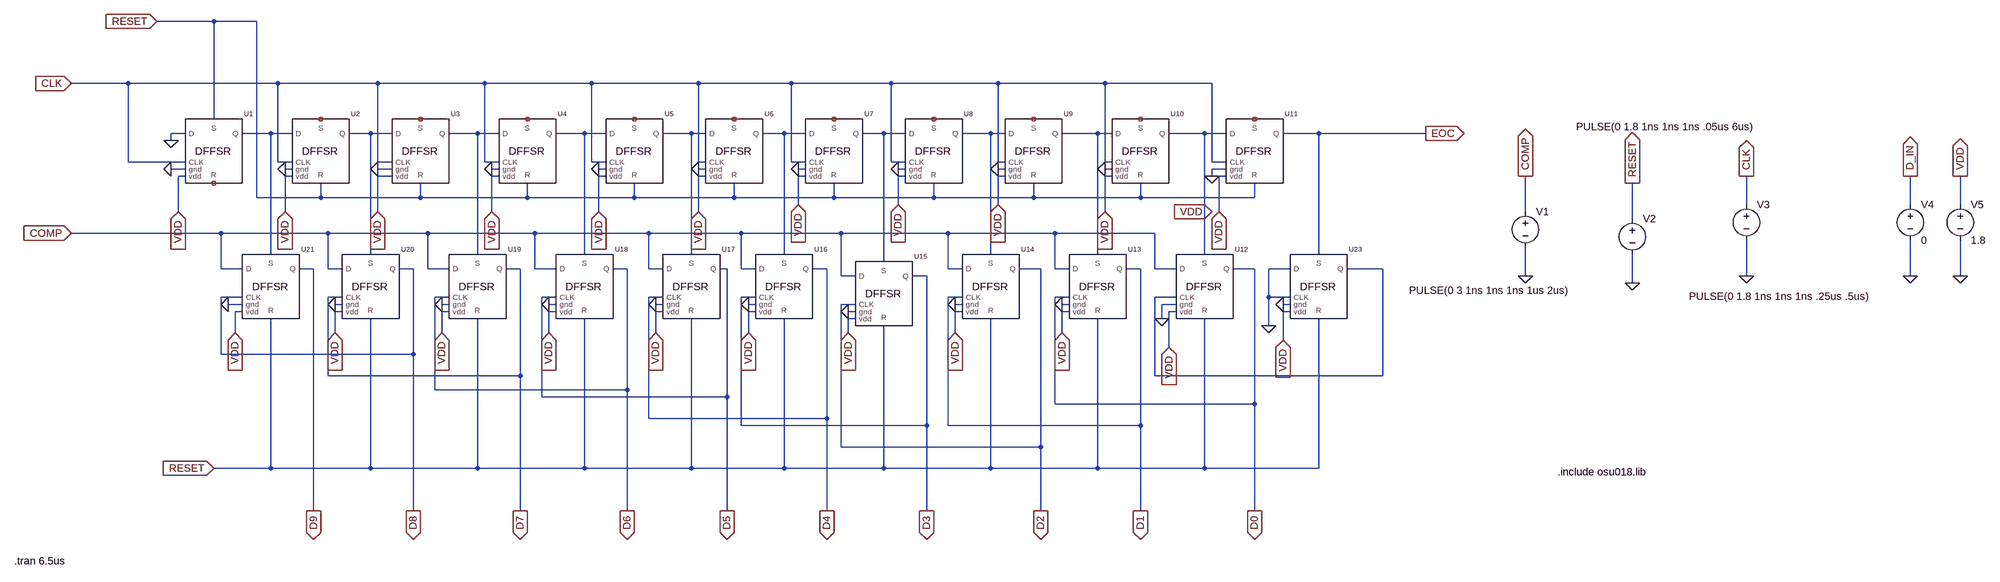
[diagram p0: schematic SARlogic_10BIT.asc]
SARlogic_10BIT.asc, the LTspice schematic file:
Version 4
SHEET 1 1368 872
WIRE -2624 -432 -2752 -432
WIRE -2528 -432 -2624 -432
WIRE -2816 -256 -2944 -256
WIRE -2480 -256 -2816 -256
WIRE -2256 -256 -2480 -256
WIRE -2016 -256 -2256 -256
WIRE -1776 -256 -2016 -256
WIRE -1536 -256 -1776 -256
WIRE -1328 -256 -1536 -256
WIRE -1104 -256 -1328 -256
WIRE -864 -256 -1104 -256
WIRE -624 -256 -864 -256
WIRE -384 -256 -624 -256
WIRE -2624 -176 -2624 -432
WIRE -2688 -144 -2720 -144
WIRE -2496 -144 -2560 -144
WIRE -2448 -144 -2496 -144
WIRE -2272 -144 -2320 -144
WIRE -2224 -144 -2272 -144
WIRE -2032 -144 -2096 -144
WIRE -1984 -144 -2032 -144
WIRE -1792 -144 -1856 -144
WIRE -1744 -144 -1792 -144
WIRE -1552 -144 -1616 -144
WIRE -1520 -144 -1552 -144
WIRE -1344 -144 -1392 -144
WIRE -1296 -144 -1344 -144
WIRE -1120 -144 -1168 -144
WIRE -1072 -144 -1120 -144
WIRE -880 -144 -944 -144
WIRE -848 -144 -880 -144
WIRE -640 -144 -720 -144
WIRE -608 -144 -640 -144
WIRE -400 -144 -480 -144
WIRE -352 -144 -400 -144
WIRE -144 -144 -224 -144
WIRE 96 -144 -144 -144
WIRE -2720 -128 -2720 -144
WIRE -2816 -80 -2816 -256
WIRE -2688 -80 -2816 -80
WIRE -2480 -80 -2480 -256
WIRE -2448 -80 -2480 -80
WIRE -2256 -80 -2256 -256
WIRE -2224 -80 -2256 -80
WIRE -2016 -80 -2016 -256
WIRE -1984 -80 -2016 -80
WIRE -1776 -80 -1776 -256
WIRE -1744 -80 -1776 -80
WIRE -1536 -80 -1536 -256
WIRE -1520 -80 -1536 -80
WIRE -1328 -80 -1328 -256
WIRE -1296 -80 -1328 -80
WIRE -1104 -80 -1104 -256
WIRE -1072 -80 -1104 -80
WIRE -864 -80 -864 -256
WIRE -848 -80 -864 -80
WIRE -624 -80 -624 -256
WIRE -608 -80 -624 -80
WIRE -384 -80 -384 -256
WIRE -352 -80 -384 -80
WIRE -2688 -64 -2720 -64
WIRE -2448 -64 -2464 -64
WIRE -2224 -64 -2256 -64
WIRE -1984 -64 -2000 -64
WIRE -1744 -64 -1760 -64
WIRE -1520 -64 -1536 -64
WIRE -1296 -64 -1312 -64
WIRE -1072 -64 -1088 -64
WIRE -848 -64 -864 -64
WIRE -608 -64 -624 -64
WIRE -352 -64 -384 -64
WIRE -2688 -48 -2704 -48
WIRE -2448 -48 -2464 -48
WIRE -2224 -48 -2256 -48
WIRE -1984 -48 -2000 -48
WIRE -1744 -48 -1760 -48
WIRE -1520 -48 -1536 -48
WIRE -1296 -48 -1312 -48
WIRE -1072 -48 -1088 -48
WIRE -848 -48 -864 -48
WIRE -608 -48 -624 -48
WIRE -384 -48 -384 -64
WIRE -352 -48 -368 -48
WIRE -2528 0 -2528 -432
WIRE -2384 0 -2384 -32
WIRE -2384 0 -2528 0
WIRE -2160 0 -2160 -32
WIRE -2160 0 -2384 0
WIRE -1920 0 -1920 -32
WIRE -1920 0 -2160 0
WIRE -1680 0 -1680 -32
WIRE -1680 0 -1920 0
WIRE -1456 0 -1456 -32
WIRE -1456 0 -1680 0
WIRE -1232 0 -1232 -32
WIRE -1232 0 -1456 0
WIRE -1008 0 -1008 -32
WIRE -1008 0 -1232 0
WIRE -784 0 -784 -32
WIRE -784 0 -1008 0
WIRE -544 0 -544 -32
WIRE -544 0 -784 0
WIRE -288 0 -288 -32
WIRE -288 0 -544 0
WIRE -1312 16 -1312 -48
WIRE -1088 16 -1088 -48
WIRE -864 16 -864 -48
WIRE 816 16 816 -48
WIRE 1184 16 1184 -48
WIRE 1296 16 1296 -48
WIRE -2704 32 -2704 -48
WIRE -2464 32 -2464 -48
WIRE -2256 32 -2256 -48
WIRE -2000 32 -2000 -48
WIRE -1760 32 -1760 -48
WIRE -1536 32 -1536 -48
WIRE -624 32 -624 -48
WIRE -368 32 -368 -48
WIRE 320 32 320 -48
WIRE 560 48 560 -32
WIRE -2608 80 -2944 80
WIRE -2368 80 -2608 80
WIRE -2144 80 -2368 80
WIRE -1904 80 -2144 80
WIRE -1648 80 -1904 80
WIRE -1440 80 -1648 80
WIRE -1216 80 -1440 80
WIRE -976 80 -1216 80
WIRE -736 80 -976 80
WIRE -512 80 -736 80
WIRE -2496 128 -2496 -144
WIRE -2272 128 -2272 -144
WIRE -2032 128 -2032 -144
WIRE -1792 128 -1792 -144
WIRE -1552 128 -1552 -144
WIRE -1344 128 -1344 -144
WIRE -880 128 -880 -144
WIRE -640 128 -640 -144
WIRE -400 128 -400 -144
WIRE -144 128 -144 -144
WIRE -1120 144 -1120 -144
WIRE -2608 160 -2608 80
WIRE -2560 160 -2608 160
WIRE -2400 160 -2432 160
WIRE -2368 160 -2368 80
WIRE -2336 160 -2368 160
WIRE -2176 160 -2208 160
WIRE -2144 160 -2144 80
WIRE -2096 160 -2144 160
WIRE -1936 160 -1968 160
WIRE -1904 160 -1904 80
WIRE -1856 160 -1904 160
WIRE -1696 160 -1728 160
WIRE -1648 160 -1648 80
WIRE -1616 160 -1648 160
WIRE -1472 160 -1488 160
WIRE -1440 160 -1440 80
WIRE -1408 160 -1440 160
WIRE -1248 160 -1280 160
WIRE -976 160 -976 80
WIRE -944 160 -976 160
WIRE -768 160 -816 160
WIRE -736 160 -736 80
WIRE -704 160 -736 160
WIRE -544 160 -576 160
WIRE -512 160 -512 80
WIRE -464 160 -512 160
WIRE -288 160 -336 160
WIRE -208 160 -256 160
WIRE 0 160 -80 160
WIRE -1216 176 -1216 80
WIRE -1184 176 -1216 176
WIRE -1024 176 -1056 176
WIRE 320 176 320 112
WIRE 816 176 816 96
WIRE 1184 176 1184 96
WIRE 1296 176 1296 96
WIRE 560 192 560 128
WIRE -2560 224 -2608 224
WIRE -2336 224 -2368 224
WIRE -2096 224 -2128 224
WIRE -1856 224 -1888 224
WIRE -1616 224 -1648 224
WIRE -1408 224 -1440 224
WIRE -944 224 -976 224
WIRE -704 224 -736 224
WIRE -464 224 -512 224
WIRE -256 224 -256 160
WIRE -208 224 -256 224
WIRE -2560 240 -2592 240
WIRE -2336 240 -2352 240
WIRE -2096 240 -2112 240
WIRE -1856 240 -1872 240
WIRE -1616 240 -1632 240
WIRE -1408 240 -1424 240
WIRE -1184 240 -1216 240
WIRE -944 240 -960 240
WIRE -704 240 -720 240
WIRE -464 240 -496 240
WIRE -208 240 -224 240
WIRE -2560 256 -2576 256
WIRE -2336 256 -2352 256
WIRE -2096 256 -2112 256
WIRE -1856 256 -1872 256
WIRE -1616 256 -1632 256
WIRE -1408 256 -1424 256
WIRE -1184 256 -1200 256
WIRE -944 256 -960 256
WIRE -704 256 -720 256
WIRE -464 256 -480 256
WIRE -208 256 -224 256
WIRE -1184 272 -1200 272
WIRE -496 272 -496 240
WIRE -256 288 -256 224
WIRE -2576 304 -2576 256
WIRE -2352 304 -2352 256
WIRE -2112 304 -2112 256
WIRE -1872 304 -1872 256
WIRE -1632 304 -1632 256
WIRE -1424 304 -1424 256
WIRE -1200 304 -1200 272
WIRE -960 304 -960 256
WIRE -720 304 -720 256
WIRE -224 320 -224 256
WIRE -480 336 -480 256
WIRE -2608 352 -2608 224
WIRE -2176 352 -2176 160
WIRE -2176 352 -2608 352
WIRE -2368 400 -2368 224
WIRE -1936 400 -1936 160
WIRE -1936 400 -2368 400
WIRE -512 400 -512 224
WIRE 0 400 0 160
WIRE 0 400 -512 400
WIRE -2128 432 -2128 224
WIRE -1696 432 -1696 160
WIRE -1696 432 -2128 432
WIRE -1888 448 -1888 224
WIRE -1472 448 -1472 160
WIRE -1472 448 -1888 448
WIRE -736 464 -736 224
WIRE -288 464 -288 160
WIRE -288 464 -736 464
WIRE -1648 496 -1648 224
WIRE -1248 496 -1248 160
WIRE -1248 496 -1648 496
WIRE -1440 512 -1440 224
WIRE -1024 512 -1024 176
WIRE -1024 512 -1440 512
WIRE -976 512 -976 224
WIRE -544 512 -544 160
WIRE -544 512 -976 512
WIRE -1216 560 -1216 240
WIRE -768 560 -768 160
WIRE -768 560 -1216 560
WIRE -2496 608 -2496 272
WIRE -2496 608 -2624 608
WIRE -2272 608 -2272 272
WIRE -2272 608 -2496 608
WIRE -2032 608 -2032 272
WIRE -2032 608 -2272 608
WIRE -1792 608 -1792 272
WIRE -1792 608 -2032 608
WIRE -1552 608 -1552 272
WIRE -1552 608 -1792 608
WIRE -1344 608 -1344 272
WIRE -1344 608 -1552 608
WIRE -1120 608 -1120 288
WIRE -1120 608 -1344 608
WIRE -880 608 -880 272
WIRE -880 608 -1120 608
WIRE -640 608 -640 272
WIRE -640 608 -880 608
WIRE -400 608 -400 272
WIRE -400 608 -640 608
WIRE -144 608 -144 272
WIRE -144 608 -400 608
WIRE -2400 704 -2400 160
WIRE -2176 704 -2176 352
WIRE -1936 704 -1936 400
WIRE -1696 704 -1696 432
WIRE -1472 704 -1472 448
WIRE -1248 704 -1248 496
WIRE -1024 704 -1024 512
WIRE -768 704 -768 560
WIRE -544 704 -544 512
WIRE -288 704 -288 464
FLAG 320 176 0
FLAG 560 192 0
FLAG 816 176 0
FLAG 1184 176 0
FLAG 1296 176 0
FLAG 560 -32 RESET
IOPIN 560 -32 Out
FLAG 816 -48 CLK
IOPIN 816 -48 Out
FLAG 1184 -48 D_IN
IOPIN 1184 -48 Out
FLAG 1296 -48 VDD
IOPIN 1296 -48 Out
FLAG 320 -48 COMP
IOPIN 320 -48 Out
FLAG -2400 704 D9
IOPIN -2400 704 Out
FLAG -2176 704 D8
IOPIN -2176 704 Out
FLAG -1936 704 D7
IOPIN -1936 704 Out
FLAG -1696 704 D6
IOPIN -1696 704 Out
FLAG -1472 704 D5
IOPIN -1472 704 Out
FLAG -1248 704 D4
IOPIN -1248 704 Out
FLAG -1024 704 D3
IOPIN -1024 704 Out
FLAG -768 704 D2
IOPIN -768 704 Out
FLAG -544 704 D1
IOPIN -544 704 Out
FLAG -288 704 D0
IOPIN -288 704 Out
FLAG 96 -144 EOC
IOPIN 96 -144 Out
FLAG -2944 -256 CLK
IOPIN -2944 -256 In
FLAG -2752 -432 RESET
IOPIN -2752 -432 In
FLAG -2944 80 COMP
IOPIN -2944 80 In
FLAG -2624 608 RESET
IOPIN -2624 608 In
FLAG -256 288 0
FLAG -2576 304 VDD
IOPIN -2576 304 In
FLAG -2352 304 VDD
IOPIN -2352 304 In
FLAG -2112 304 VDD
IOPIN -2112 304 In
FLAG -1872 304 VDD
IOPIN -1872 304 In
FLAG -1632 304 VDD
IOPIN -1632 304 In
FLAG -1200 304 VDD
IOPIN -1200 304 In
FLAG -1424 304 VDD
IOPIN -1424 304 In
FLAG -960 304 VDD
IOPIN -960 304 In
FLAG -720 304 VDD
IOPIN -720 304 In
FLAG -480 336 VDD
IOPIN -480 336 In
FLAG -2000 32 VDD
IOPIN -2000 32 In
FLAG -1760 32 VDD
IOPIN -1760 32 In
FLAG -1536 32 VDD
IOPIN -1536 32 In
FLAG -1312 16 VDD
IOPIN -1312 16 In
FLAG -1088 16 VDD
IOPIN -1088 16 In
FLAG -864 16 VDD
IOPIN -864 16 In
FLAG -624 32 VDD
IOPIN -624 32 In
FLAG -384 32 VDD
IOPIN -384 32 In
FLAG -368 32 VDD
IOPIN -368 32 In
FLAG -2464 32 VDD
IOPIN -2464 32 In
FLAG -2704 32 VDD
IOPIN -2704 32 In
FLAG -2256 32 VDD
IOPIN -2256 32 In
FLAG -2720 -64 0
FLAG -2464 -64 0
FLAG -2256 -64 0
FLAG -2000 -64 0
FLAG -1760 -64 0
FLAG -1536 -64 0
FLAG -1312 -64 0
FLAG -1088 -64 0
FLAG -864 -64 0
FLAG -2592 240 0
FLAG -2352 240 0
FLAG -2112 240 0
FLAG -1872 240 0
FLAG -1632 240 0
FLAG -1424 240 0
FLAG -1200 256 0
FLAG -960 240 0
FLAG -720 240 0
FLAG -2720 -128 0
FLAG -624 -64 0
FLAG -384 -48 0
FLAG -496 272 0
FLAG -224 240 0
FLAG -224 320 VDD
IOPIN -224 320 In
SYMBOL voltage 320 16 R0
WINDOW 3 -261 193 Left 2
WINDOW 123 0 0 Left 0
WINDOW 39 0 0 Left 0
SYMATTR Value PULSE(0 3 1ns 1ns 1ns 1us 2us)
SYMATTR InstName V1
SYMBOL voltage 560 32 R0
WINDOW 3 -126 -191 Left 2
WINDOW 123 0 0 Left 0
WINDOW 39 0 0 Left 0
SYMATTR Value PULSE(0 1.8 1ns 1ns 1ns .05us 6us)
SYMATTR InstName V2
SYMBOL voltage 816 0 R0
WINDOW 3 -129 222 Left 2
WINDOW 123 0 0 Left 0
WINDOW 39 0 0 Left 0
SYMATTR Value PULSE(0 1.8 1ns 1ns 1ns .25us .5us)
SYMATTR InstName V3
SYMBOL voltage 1184 0 R0
WINDOW 123 0 0 Left 0
WINDOW 39 0 0 Left 0
SYMATTR InstName V4
SYMATTR Value 0
SYMBOL voltage 1296 0 R0
WINDOW 123 0 0 Left 0
WINDOW 39 0 0 Left 0
SYMATTR InstName V5
SYMATTR Value 1.8
SYMBOL AutoGenerated\\DFFSR -2624 -112 R0
SYMATTR InstName U1
SYMATTR Value2 vhigh=1.8 vlow=0
SYMATTR SpiceLine Trise=1ns Tfall=1ns
SYMBOL AutoGenerated\\DFFSR -2384 -112 R0
SYMATTR InstName U2
SYMATTR SpiceLine Trise=1ns Tfall=1ns
SYMATTR Value2 vhigh=1.8 vlow=0
SYMBOL AutoGenerated\\DFFSR -2160 -112 R0
SYMATTR InstName U3
SYMATTR SpiceLine Trise=1ns Tfall=1ns
SYMATTR Value2 vhigh=1.8 vlow=0
SYMBOL AutoGenerated\\DFFSR -1920 -112 R0
SYMATTR InstName U4
SYMATTR SpiceLine Trise=1ns Tfall=1ns
SYMATTR Value2 vhigh=1.8 vlow=0
SYMBOL AutoGenerated\\DFFSR -1680 -112 R0
SYMATTR InstName U5
SYMATTR SpiceLine Trise=1ns Tfall=1ns
SYMATTR Value2 vhigh=1.8 vlow=0
SYMBOL AutoGenerated\\DFFSR -1456 -112 R0
SYMATTR InstName U6
SYMATTR SpiceLine Trise=1ns Tfall=1ns
SYMATTR Value2 vhigh=1.8 vlow=0
SYMBOL AutoGenerated\\DFFSR -1232 -112 R0
SYMATTR InstName U7
SYMATTR SpiceLine Trise=1ns Tfall=1ns
SYMATTR Value2 vhigh=1.8 vlow=0
SYMBOL AutoGenerated\\DFFSR -1008 -112 R0
SYMATTR InstName U8
SYMATTR SpiceLine Trise=1ns Tfall=1ns
SYMATTR Value2 vhigh=1.8 vlow=0
SYMBOL AutoGenerated\\DFFSR -784 -112 R0
SYMATTR InstName U9
SYMATTR SpiceLine Trise=1ns Tfall=1ns
SYMATTR Value2 vhigh=1.8 vlow=0
SYMBOL AutoGenerated\\DFFSR -544 -112 R0
SYMATTR InstName U10
SYMATTR SpiceLine Trise=1ns Tfall=1ns
SYMATTR Value2 vhigh=1.8 vlow=0
SYMBOL AutoGenerated\\DFFSR -288 -112 R0
SYMATTR InstName U11
SYMATTR SpiceLine Trise=1ns Tfall=1ns
SYMATTR Value2 vhigh=1.8 vlow=0
SYMBOL AutoGenerated\\DFFSR -400 192 R0
SYMATTR InstName U12
SYMATTR SpiceLine Trise=1ns Tfall=1ns
SYMATTR Value2 vhigh=1.8 vlow=0
SYMBOL AutoGenerated\\DFFSR -640 192 R0
SYMATTR InstName U13
SYMATTR SpiceLine Trise=1ns Tfall=1ns
SYMATTR Value2 vhigh=1.8 vlow=0
SYMBOL AutoGenerated\\DFFSR -880 192 R0
SYMATTR InstName U14
SYMATTR SpiceLine Trise=1ns Tfall=1ns
SYMATTR Value2 vhigh=1.8 vlow=0
SYMBOL AutoGenerated\\DFFSR -1120 208 R0
SYMATTR InstName U15
SYMATTR SpiceLine Trise=1ns Tfall=1ns
SYMATTR Value2 vhigh=1.8 vlow=0
SYMBOL AutoGenerated\\DFFSR -1344 192 R0
SYMATTR InstName U16
SYMATTR SpiceLine Trise=1ns Tfall=1ns
SYMATTR Value2 vhigh=1.8 vlow=0
SYMBOL AutoGenerated\\DFFSR -1552 192 R0
SYMATTR InstName U17
SYMATTR SpiceLine Trise=1ns Tfall=1ns
SYMATTR Value2 vhigh=1.8 vlow=0
SYMBOL AutoGenerated\\DFFSR -1792 192 R0
SYMATTR InstName U18
SYMATTR SpiceLine Trise=1ns Tfall=1ns
SYMATTR Value2 vhigh=1.8 vlow=0
SYMBOL AutoGenerated\\DFFSR -2032 192 R0
SYMATTR InstName U19
SYMATTR SpiceLine Trise=1ns Tfall=1ns
SYMATTR Value2 vhigh=1.8 vlow=0
SYMBOL AutoGenerated\\DFFSR -2272 192 R0
SYMATTR InstName U20
SYMATTR SpiceLine Trise=1ns Tfall=1ns
SYMATTR Value2 vhigh=1.8 vlow=0
SYMBOL AutoGenerated\\DFFSR -2496 192 R0
SYMATTR InstName U21
SYMATTR SpiceLine Trise=1ns Tfall=1ns
SYMATTR Value2 vhigh=1.8 vlow=0
SYMBOL AutoGenerated\\DFFSR -144 192 R0
SYMATTR InstName U23
SYMATTR SpiceLine Trise=1ns Tfall=1ns
SYMATTR Value2 vhigh=1.8 vlow=0
TEXT -3072 816 Left 2 !.tran 6.5us
TEXT 392 616 Left 2 !.include osu018.lib

The netlist it stands for:
* SARlogic_10BIT.asc
V1 COMP 0 PULSE(0 3 1ns 1ns 1ns 1us 2us)
V2 RESET 0 PULSE(0 1.8 1ns 1ns 1ns .05us 6us)
V3 CLK 0 PULSE(0 1.8 1ns 1ns 1ns .25us .5us)
V4 D_IN 0 0
V5 VDD 0 1.8
XU1 0 VDD 0 RESET NC_01 N001 CLK DFFSR vhigh=1.8 vlow=0 Trise=1ns Tfall=1ns  ; pins gnd vdd D S R Q CLK
XU2 0 VDD N001 NC_02 RESET N002 CLK DFFSR vhigh=1.8 vlow=0 Trise=1ns Tfall=1ns  ; pins gnd vdd D S R Q CLK
XU3 0 VDD N002 NC_03 RESET N003 CLK DFFSR vhigh=1.8 vlow=0 Trise=1ns Tfall=1ns  ; pins gnd vdd D S R Q CLK
XU4 0 VDD N003 NC_04 RESET N004 CLK DFFSR vhigh=1.8 vlow=0 Trise=1ns Tfall=1ns  ; pins gnd vdd D S R Q CLK
XU5 0 VDD N004 NC_05 RESET N005 CLK DFFSR vhigh=1.8 vlow=0 Trise=1ns Tfall=1ns  ; pins gnd vdd D S R Q CLK
XU6 0 VDD N005 NC_06 RESET N006 CLK DFFSR vhigh=1.8 vlow=0 Trise=1ns Tfall=1ns  ; pins gnd vdd D S R Q CLK
XU7 0 VDD N006 NC_07 RESET N007 CLK DFFSR vhigh=1.8 vlow=0 Trise=1ns Tfall=1ns  ; pins gnd vdd D S R Q CLK
XU8 0 VDD N007 NC_08 RESET N008 CLK DFFSR vhigh=1.8 vlow=0 Trise=1ns Tfall=1ns  ; pins gnd vdd D S R Q CLK
XU9 0 VDD N008 NC_09 RESET N009 CLK DFFSR vhigh=1.8 vlow=0 Trise=1ns Tfall=1ns  ; pins gnd vdd D S R Q CLK
XU10 0 VDD N009 NC_10 RESET N010 CLK DFFSR vhigh=1.8 vlow=0 Trise=1ns Tfall=1ns  ; pins gnd vdd D S R Q CLK
XU11 0 VDD N010 NC_11 RESET EOC CLK DFFSR vhigh=1.8 vlow=0 Trise=1ns Tfall=1ns  ; pins gnd vdd D S R Q CLK
XU12 0 VDD COMP N010 RESET D0 N011 DFFSR vhigh=1.8 vlow=0 Trise=1ns Tfall=1ns  ; pins gnd vdd D S R Q CLK
XU13 0 VDD COMP N009 RESET D1 D0 DFFSR vhigh=1.8 vlow=0 Trise=1ns Tfall=1ns  ; pins gnd vdd D S R Q CLK
XU14 0 VDD COMP N008 RESET D2 D1 DFFSR vhigh=1.8 vlow=0 Trise=1ns Tfall=1ns  ; pins gnd vdd D S R Q CLK
XU15 0 VDD COMP N007 RESET D3 D2 DFFSR vhigh=1.8 vlow=0 Trise=1ns Tfall=1ns  ; pins gnd vdd D S R Q CLK
XU16 0 VDD COMP N006 RESET D4 D3 DFFSR vhigh=1.8 vlow=0 Trise=1ns Tfall=1ns  ; pins gnd vdd D S R Q CLK
XU17 0 VDD COMP N005 RESET D5 D4 DFFSR vhigh=1.8 vlow=0 Trise=1ns Tfall=1ns  ; pins gnd vdd D S R Q CLK
XU18 0 VDD COMP N004 RESET D6 D5 DFFSR vhigh=1.8 vlow=0 Trise=1ns Tfall=1ns  ; pins gnd vdd D S R Q CLK
XU19 0 VDD COMP N003 RESET D7 D6 DFFSR vhigh=1.8 vlow=0 Trise=1ns Tfall=1ns  ; pins gnd vdd D S R Q CLK
XU20 0 VDD COMP N002 RESET D8 D7 DFFSR vhigh=1.8 vlow=0 Trise=1ns Tfall=1ns  ; pins gnd vdd D S R Q CLK
XU21 0 VDD COMP N001 RESET D9 D8 DFFSR vhigh=1.8 vlow=0 Trise=1ns Tfall=1ns  ; pins gnd vdd D S R Q CLK
XU23 0 VDD 0 EOC RESET N011 0 DFFSR vhigh=1.8 vlow=0 Trise=1ns Tfall=1ns  ; pins gnd vdd D S R Q CLK
.tran 6.5us
.include osu018.lib
.lib C:\Users\Hp\Documents\LTspiceXVII\active_high.cir
.backanno
.end